# EAGLE design Writer (EAGLE 6.5.0)
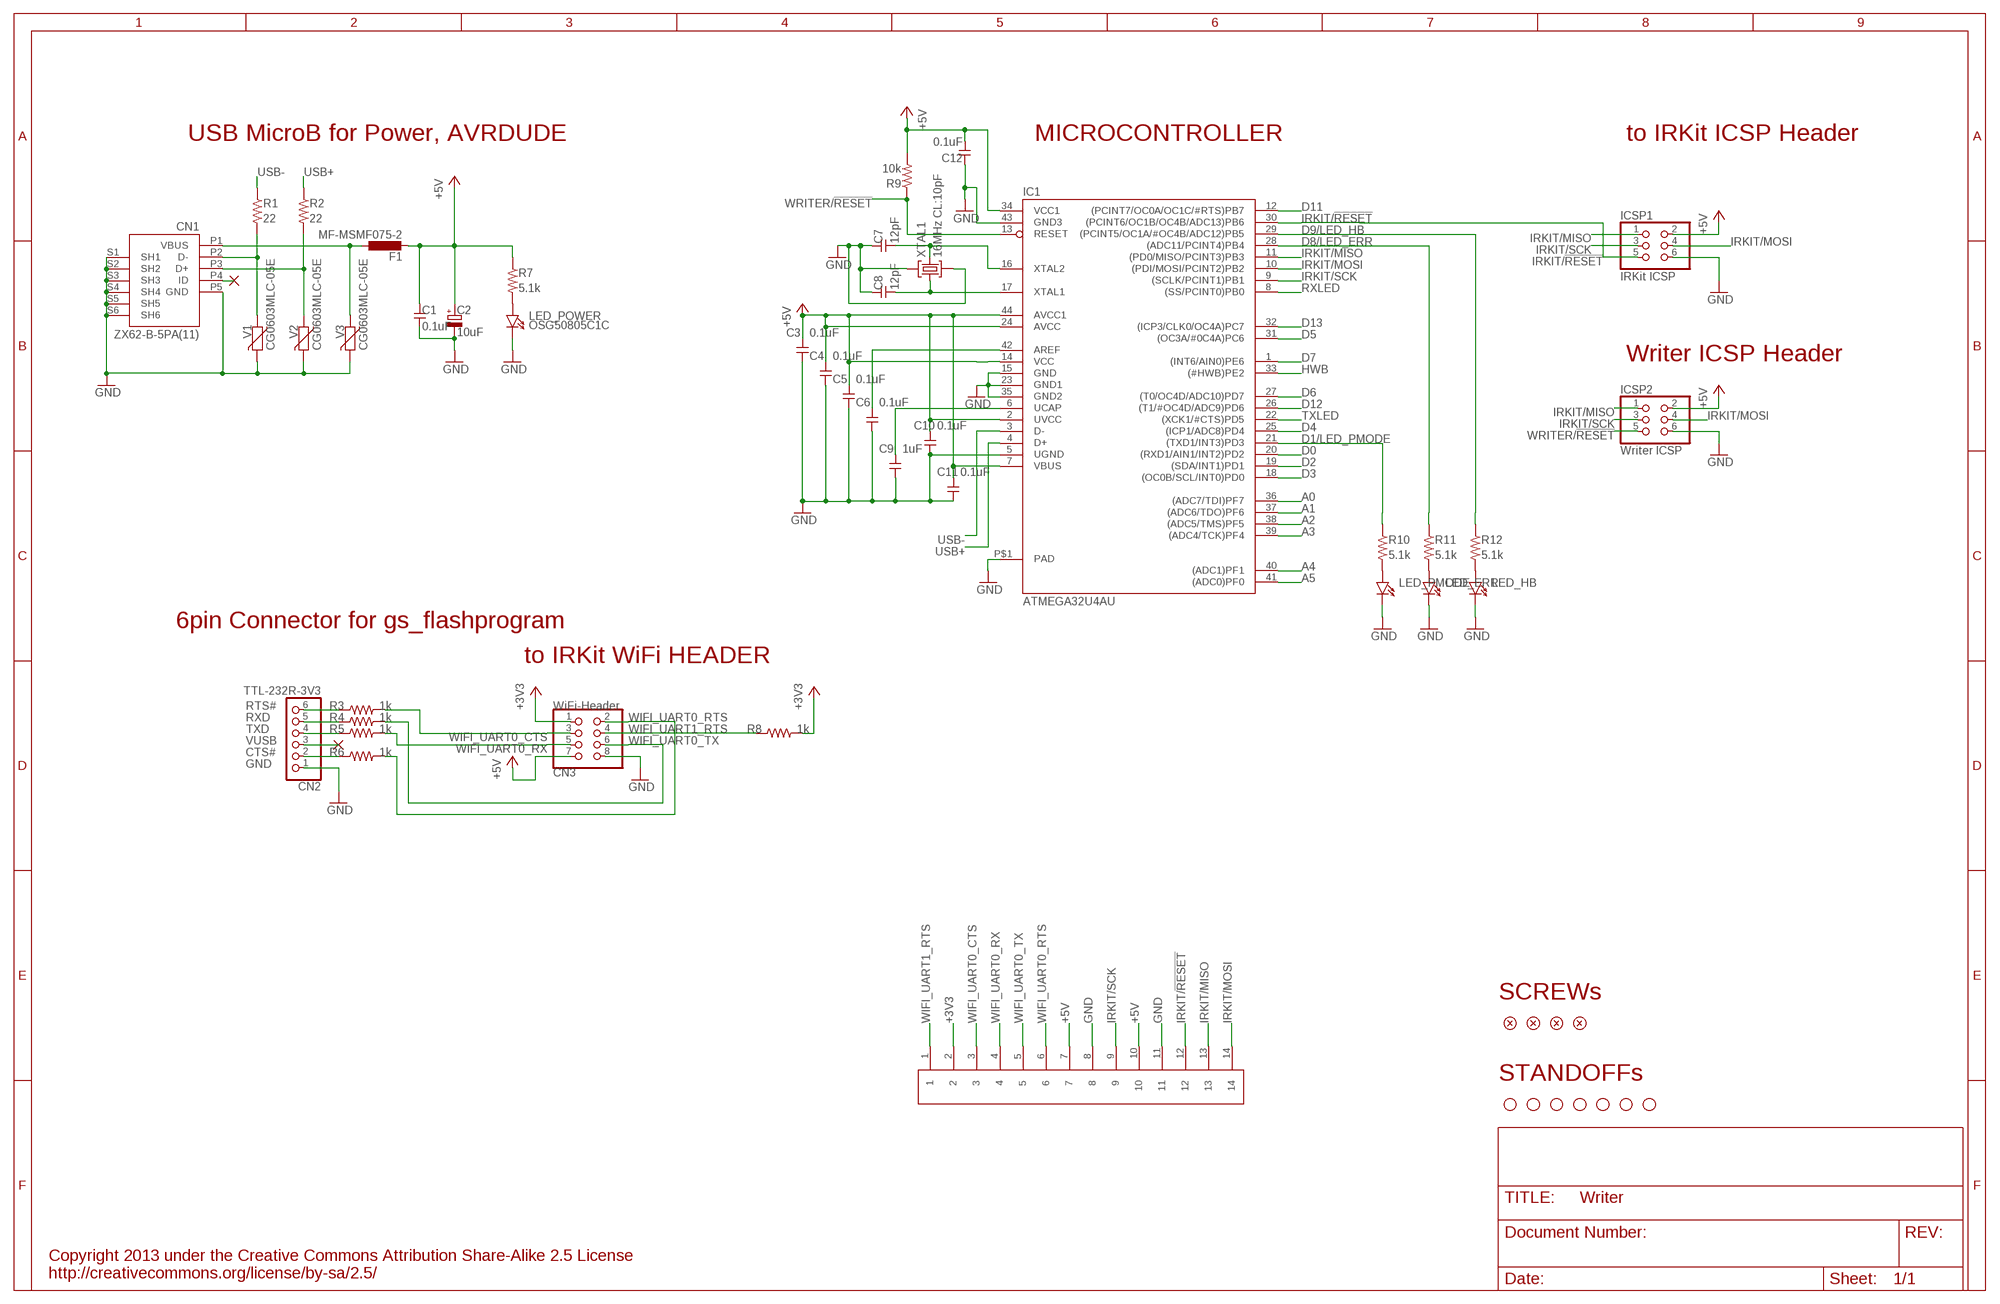
[diagram p0: schematic, sheet 1]

## Parts
C1  0.1uF  CAPACITOR2012  [SMD2012]
C2  10uF  CAPACITOR-POLPANASONIC_B  [PANASONIC_B]
C3  0.1uF  CAPACITOR2012  [SMD2012]
C4  0.1uF  CAPACITOR2012  [SMD2012]
C5  0.1uF  CAPACITOR2012  [SMD2012]
C6  0.1uF  CAPACITOR2012  [SMD2012]
C7  12pF  CAPACITOR2012  [SMD2012]
C8  12pF  CAPACITOR2012  [SMD2012]
C9  1uF  CAPACITOR2012  [SMD2012]
C10  0.1uF  CAPACITOR2012  [SMD2012]
C11  0.1uF  CAPACITOR2012  [SMD2012]
C12  0.1uF  CAPACITOR2012  [SMD2012]
CN1  ZX62-B-5PA(11)  USB-CONNECTORMICROB  [USB-MICROB]
CN2  TTL-232R-3V3  PINHD-1X6/90  [1X06/90]
CN3  WiFi-Header  PINHD-2X4/D1.1  [2X04/D1.1]
CN4  SOCKET-HEADER-7614-5002  [SOCKET-HEADER-7614-5002]
F1  MF-MSMF075-2  L-EUL1812  [L1812]
IC1  ATMEGA32U4AU  [TQFP44-PAD]
ICSP1  IRKit ICSP  PINHD-2X3/D1.1  [2X03/D1.1]
ICSP2  Writer ICSP  PINHD-2X3  [2X03]
LED_ERR  LED-2012  [LED2012]
LED_HB  LED-2012  [LED2012]
LED_PMODE  LED-2012  [LED2012]
LED_POWER  OSG50805C1C  LED-2012  [LED2012]
R1  22  RESISTOR-US2012  [SMD2012]
R2  22  RESISTOR-US2012  [SMD2012]
R3  1k  RESISTOR-US2012  [SMD2012]
R4  1k  RESISTOR-US2012  [SMD2012]
R5  1k  RESISTOR-US2012  [SMD2012]
R6  1k  RESISTOR-US2012  [SMD2012]
R7  5.1k  RESISTOR-US2012  [SMD2012]
R8  1k  RESISTOR-US2012  [SMD2012]
R9  10k  RESISTOR-US2012  [SMD2012]
R10  5.1k  RESISTOR-US2012  [SMD2012]
R11  5.1k  RESISTOR-US2012  [SMD2012]
R12  5.1k  RESISTOR-US2012  [SMD2012]
SCREW1  flat-head M3 self-tapping  SCREW  [SCREW-M3]
SCREW2  flat-head M3 self-tapping  SCREW  [SCREW-M3]
SCREW3  flat-head M3 self-tapping  SCREW  [SCREW-M3]
SCREW4  flat-head M3 self-tapping  SCREW  [SCREW-M3]
STANDOFF1  STAND-OFF  [STAND-OFF]
STANDOFF2  STAND-OFF  [STAND-OFF]
STANDOFF3  STAND-OFF  [STAND-OFF]
STANDOFF4  STAND-OFF  [STAND-OFF]
STANDOFF5  STAND-OFF  [STAND-OFF]
STANDOFF6  STAND-OFF  [STAND-OFF]
STANDOFF7  STAND-OFF  [STAND-OFF]
V1  CG0603MLC-05E  VARISTORCN0603  [CT/CN0603]
V2  CG0603MLC-05E  VARISTORCN0603  [CT/CN0603]
V3  CG0603MLC-05E  VARISTORCN0603  [CT/CN0603]
XTAL1  16MHz CL:10pF  CRYSTAL-3.2-2.5  [CRYSTAL-3.2-2.5]

## Nets
+3V3 [3.3v]: CN3.1 CN4.2 R8.2
+5V [power]: C1.1 C2.+ C3.2 C4.2 C5.2 C10.2 C11.2 C12.2 CN3.7 CN4.7 CN4.10 F1.2 IC1.2(UVCC) IC1.7(VBUS) IC1.14(VCC) IC1.24(AVCC) IC1.34(VCC1) IC1.44(AVCC1) ICSP1.2 ICSP2.2 R7.1 R9.2
A0: IC1.36((ADC7/TDI)PF7)
A1: IC1.37((ADC6/TDO)PF6)
A2: IC1.38((ADC5/TMS)PF5)
A3: IC1.39((ADC4/TCK)PF4)
A4: IC1.40((ADC1)PF1)
A5: IC1.41((ADC0)PF0)
AREF [power]: C6.2 IC1.42(AREF)
CTS#: CN2.2 R6.1
D0: IC1.20((RXD1/AIN1/INT2)PD2)
D1/LED_PMODE: IC1.21((TXD1/INT3)PD3) R10.1
D2: IC1.19((SDA/INT1)PD1)
D3: IC1.18((OC0B/SCL/INT0)PD0)
D4: IC1.25((ICP1/ADC8)PD4)
D5: IC1.31((OC3A/#0C4A)PC6)
D6: IC1.27((T0/OC4D/ADC10)PD7)
D7: IC1.1((INT6/AIN0)PE6)
D8/LED_ERR: IC1.28((ADC11/PCINT4)PB4) R11.1
D9/LED_HB: IC1.29((PCINT5/OC1A/#OC4B/ADC12)PB5) R12.1
D11: IC1.12((PCINT7/OC0A/OC1C/#RTS)PB7)
D12: IC1.26((T1/#OC4D/ADC9)PD6)
D13: IC1.32((ICP3/CLK0/OC4A)PC7)
GND [gnd]: C1.2 C2.- C3.1 C4.1 C5.1 C6.1 C7.1 C8.1 C9.1 C10.1 C11.1 C12.1 CN1.P5(GND) CN1.S1(SH1) CN1.S2(SH2) CN1.S3(SH3) CN1.S4(SH4) CN1.S5(SH5) CN1.S6(SH6) CN2.1 CN3.8 CN4.8 CN4.11 IC1.5(UGND) IC1.15(GND) IC1.23(GND1) IC1.35(GND2) IC1.43(GND3) IC1.P$1(PAD) ICSP1.6 ICSP2.6 LED_ERR.K LED_HB.K LED_PMODE.K LED_POWER.K V1.2 V2.2 V3.2 XTAL1.2(GND) XTAL1.4(GND)
HWB: IC1.33((#HWB)PE2)
IRKIT/!RESET: CN4.12 IC1.30((PCINT6/OC1B/OC4B/ADC13)PB6) ICSP1.5
IRKIT/MISO: CN4.13 IC1.11((PD0/MISO/PCINT3)PB3) ICSP1.1 ICSP2.1
IRKIT/MOSI: CN4.14 IC1.10((PDI/MOSI/PCINT2)PB2) ICSP1.4 ICSP2.4
IRKIT/SCK: CN4.9 IC1.9((SCLK/PCINT1)PB1) ICSP1.3 ICSP2.3
N$1: LED_PMODE.A R10.2
N$2: LED_ERR.A R11.2
N$3: LED_POWER.A R7.2
N$4: LED_HB.A R12.2
N$48: CN1.P2(D-) R1.2 V1.1
N$51: CN1.P3(D+) R2.2 V2.1
N$52: CN1.P1(VBUS) F1.1 V3.1
RTS#: CN2.6 R3.1
RXD: CN2.5 R4.1
RXLED: IC1.8((SS/PCINT0)PB0)
TXD: CN2.4 R5.1
TXLED: IC1.22((XCK1/#CTS)PD5)
UCAP: C9.2 IC1.6(UCAP)
USB+: IC1.4(D+) R2.1
USB-: IC1.3(D-) R1.1
USB-ID: CN1.P4(ID)
VUSB: CN2.3
WIFI_UART0_CTS: CN3.3 CN4.3 R3.2
WIFI_UART0_RTS: CN3.2 CN4.6 R6.2
WIFI_UART0_RX: CN3.5 CN4.4 R5.2
WIFI_UART0_TX: CN3.6 CN4.5 R4.2
WIFI_UART1_RTS: CN3.4 CN4.1 R8.1
WRITER/!RESET: IC1.13(RESET) ICSP2.5 R9.1
XTAL1: C8.2 IC1.17(XTAL1) XTAL1.1(C1)
XTAL2: C7.2 IC1.16(XTAL2) XTAL1.3(C2)

## Notes on the sheet
- USB MicroB for Power, AVRDUDE | MICROCONTROLLER | to IRKit ICSP Header
- Writer ICSP Header
- 6pin Connector for gs_flashprogram
- to IRKit WiFi HEADER
- SCREWs
- STANDOFFs
- Copyright 2013 under the Creative Commons Attribution Share-Alike 2.5 License
  http://creativecommons.org/license/by-sa/2.5/

## Library data of the parts
C1 C3-C12 = my:CAPACITOR: Generic Capacitor
C2 = my:CAPACITOR-POL: Generic Capacitor with Polarity
CN1 = my:USB-CONNECTOR
CN2 = my:PINHD-1X6: PIN HEADER
CN3 = my:PINHD-2X4: PIN HEADER
CN4 = my:SOCKET-HEADER: Sumitomo Standard Socket <www.mmm.co.jp/electrical/connector/list_c.html>
F1 = my:L-EU: INDUCTOR, European symbol
IC1 = my:ATMEGA32U4
ICSP1 ICSP2 = my:PINHD-2X3: PIN HEADER
LED_ERR LED_HB LED_PMODE LED_POWER = my:LED: Through-hole LED
R1-R12 = my:RESISTOR-US: Generic Registor
SCREW1-SCREW4 = my:SCREW
STANDOFF1-STANDOFF7 = my:STAND-OFF: #4 Stand Off This is the mechanical footprint for a #4 phillips button head screw. Use the keepout ring to avoid running the screw head into surrounding components. SKU : PRT-00447
V1-V3 = my:VARISTOR: VARISTOR
XTAL1 = my:CRYSTAL-3.2-2.5

## Net classes
0 default: width 0.254 mm
1 power: width 0.406 mm
2 ir-power: width 0.813 mm
3 gnd: width 0.406 mm
4 3.3v: width 0.406 mm

## Board
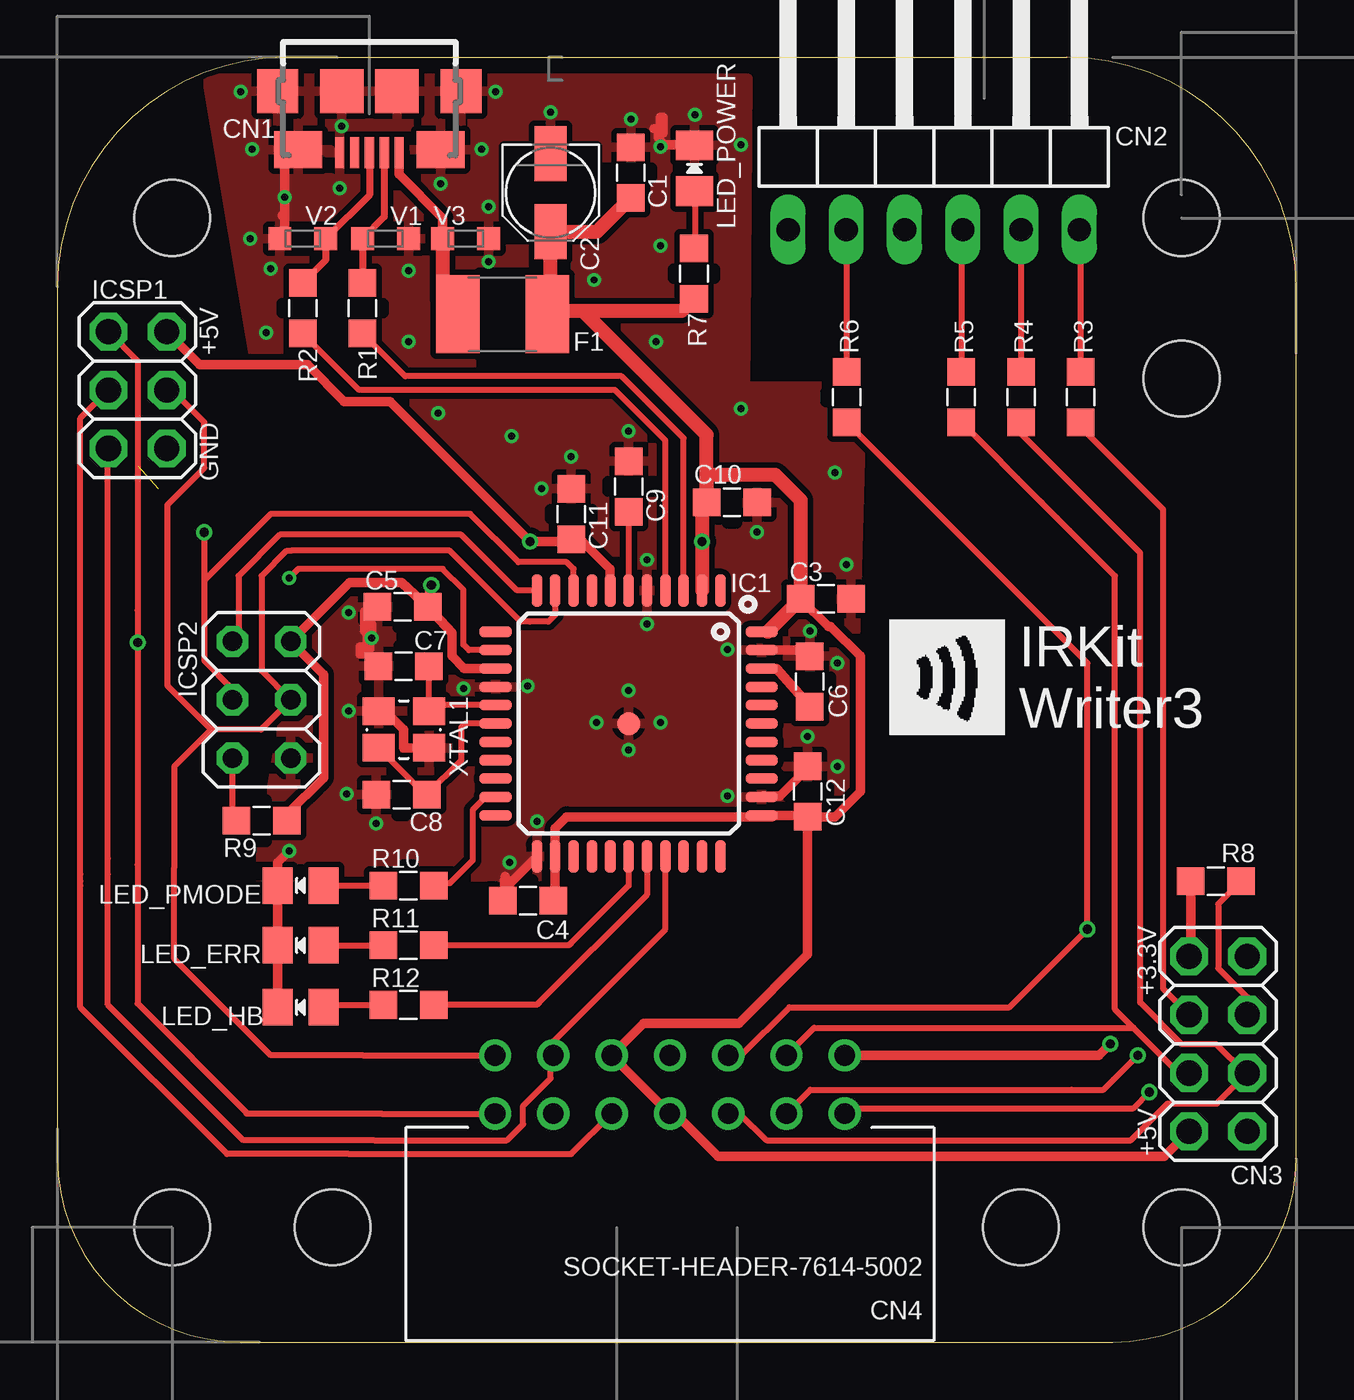
[diagram p1: board, top side]
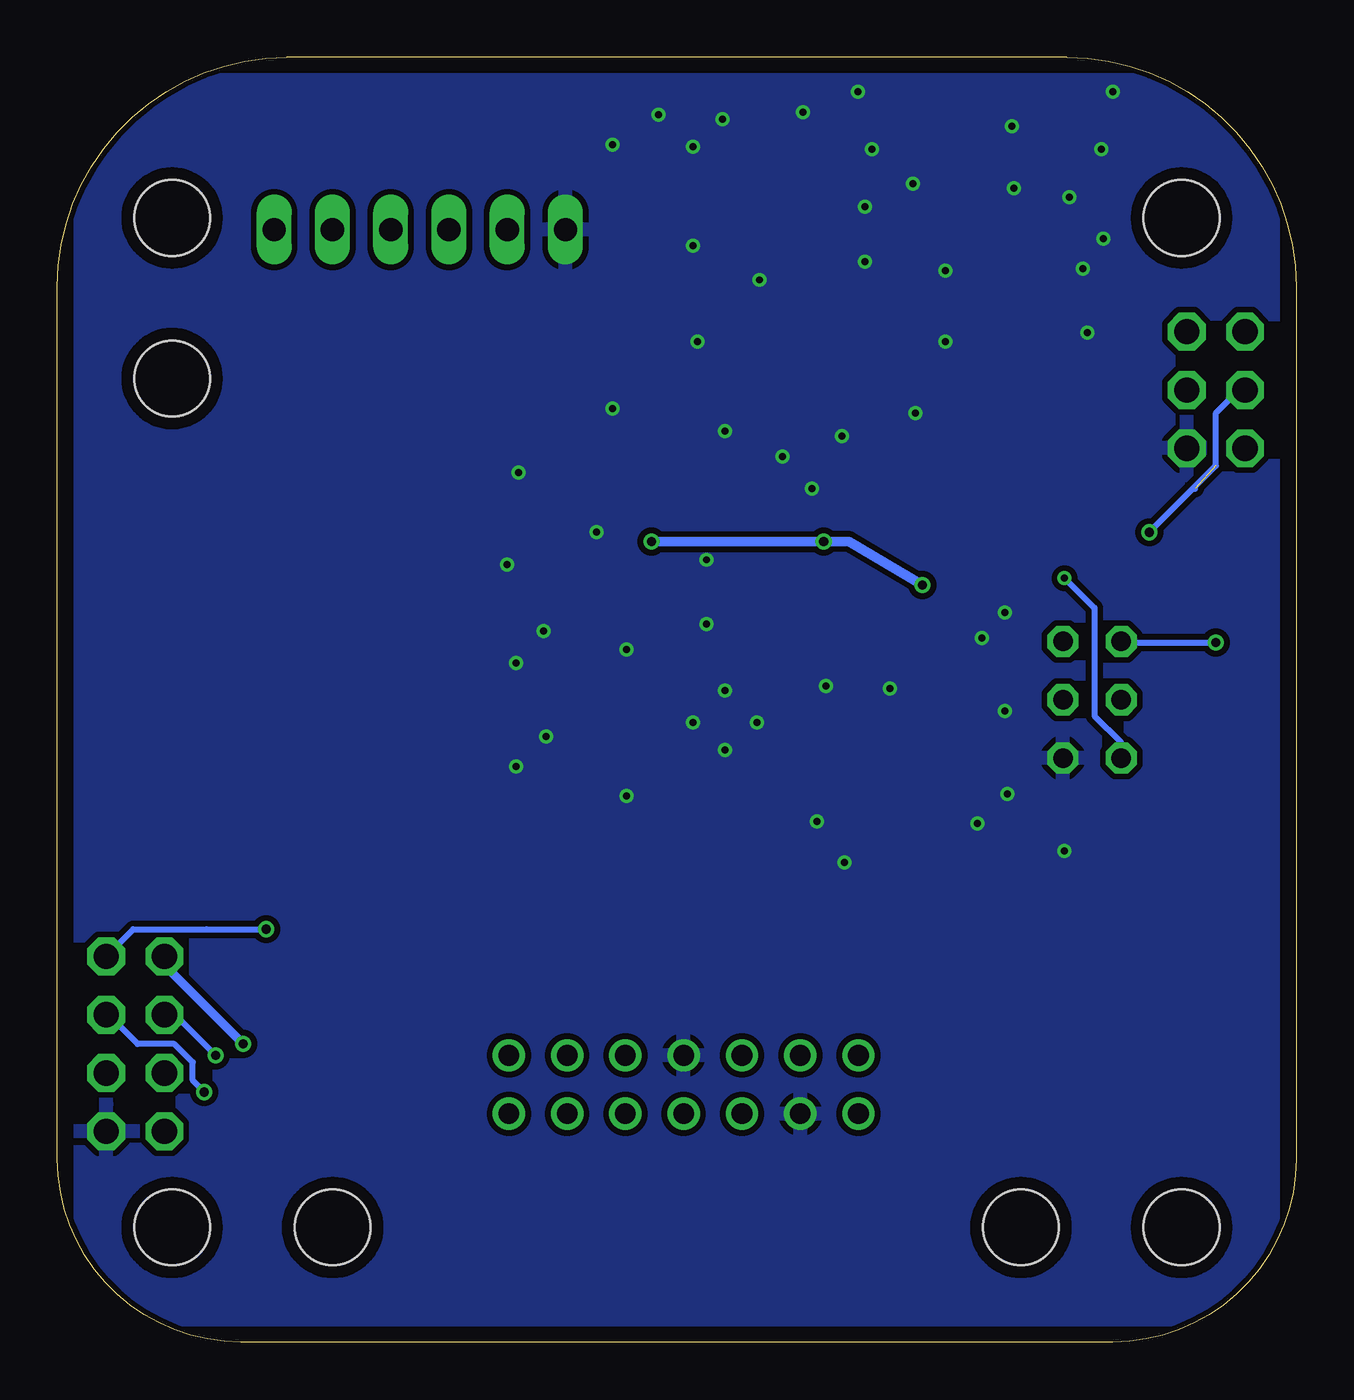
[diagram p2: board, bottom side, seen from below]

Size 54 x 56 mm. Coordinates in mm from the lower left corner, seen from the top.
Outline: 8,0 46,0 arc90 54,8 54,17.5 54,34.8 54,46 arc90 44,56 34.1,56 34,56 20,56 10,56 arc90 0,46 0,8 arc90 8,0
Copper layers (1*16): Top 0.035mm / dielectric 1.5mm / Bottom 0.035mm
Design rules "Fusion_eagle_rule_v1.1": minimum track width 6mil, minimum drill 12mil, track to track 6mil, track to pad 6mil, pad to pad 6mil, via to via 6mil, smd to smd 0mil, copper to edge 10mil, drill to drill 10mil, minimum pad ring 10mil, minimum via ring 6mil, stop-mask expansion 2mil, vias tented up to drill 100mil, thermal gap 10mil

### Footprints (pad centres in the part's own frame; a part is rotated, then mirrored left to right if it is on the bottom)
SMD2012 = smd 1.2 x 1.2: 1 -1.1,0; 2 1.1,0
PANASONIC_B = smd 2.4 x 1.4: + 1.7,0; - -1.7,0
USB-MICROB = smd 0.4 x 1.35: P1 -1.3,2.675; P2 -0.65,2.675; P3 0,2.675; P4 0.65,2.675; P5 1.3,2.675 | smd 1.8 x 1.9: S1 -4,0; S2 4,0 | smd 2.1 x 1.6: S3 -3.1,2.55; S4 3.1,2.55 | smd 1.9 x 1.9: S5 -1.2,0; S6 1.2,0
1X06/90 = drill 1.016 long: 1 -6.35,-3.81; 2 -3.81,-3.81; 3 -1.27,-3.81; 4 1.27,-3.81; 5 3.81,-3.81; 6 6.35,-3.81
2X04/D1.1 = drill 1.1 octagon: 1 -3.81,-1.27; 2 -3.81,1.27; 3 -1.27,-1.27; 4 -1.27,1.27; 5 1.27,-1.27; 6 1.27,1.27; 7 3.81,-1.27; 8 3.81,1.27
SOCKET-HEADER-7614-5002 = drill 0.9: 1 -7.62,2.54; 2 -7.62,0; 3 -5.08,2.54; 4 -5.08,0; 5 -2.54,2.54; 6 -2.54,0; 7 0,2.54; 8 0,0; 9 2.54,2.54; 10 2.54,0; 11 5.08,2.54; 12 5.08,0; 13 7.62,2.54; 14 7.62,0
L1812 = smd 1.9 x 3.4: 1 -1.95,0; 2 1.95,0
TQFP44-PAD = smd 1.4 x 0.45: 1 -5.8,4; 2 -5.8,3.2; 3 -5.8,2.4; 4 -5.8,1.6; 5 -5.8,0.8; 6 -5.8,0; 7 -5.8,-0.8; 8 -5.8,-1.6; 9 -5.8,-2.4; 10 -5.8,-3.2; 11 -5.8,-4; 23 5.8,-4; 24 5.8,-3.2; 25 5.8,-2.4; 26 5.8,-1.6; 27 5.8,-0.8; 28 5.8,0; 29 5.8,0.8; 30 5.8,1.6; 31 5.8,2.4; 32 5.8,3.2; 33 5.8,4 | smd 0.45 x 1.4: 12 -4,-5.8; 13 -3.2,-5.8; 14 -2.4,-5.8; 15 -1.6,-5.8; 16 -0.8,-5.8; 17 0,-5.8; 18 0.8,-5.8; 19 1.6,-5.8; 20 2.4,-5.8; 21 3.2,-5.8; 22 4,-5.8; 34 4,5.8; 35 3.2,5.8; 36 2.4,5.8; 37 1.6,5.8; 38 0.8,5.8; 39 0,5.8; 40 -0.8,5.8; 41 -1.6,5.8; 42 -2.4,5.8; 43 -3.2,5.8; 44 -4,5.8 | smd 1 x 1: P$1 0,0
2X03/D1.1 = drill 1.1 octagon: 1 -2.54,-1.27; 2 -2.54,1.27; 3 0,-1.27; 4 0,1.27; 5 2.54,-1.27; 6 2.54,1.27
2X03 = drill 0.85 octagon: 1 -2.54,-1.27; 2 -2.54,1.27; 3 0,-1.27; 4 0,1.27; 5 2.54,-1.27; 6 2.54,1.27
LED2012 = smd 1.3 x 1.6: A -1,0; K 1,0
STAND-OFF = hole 3.302: 0,0
CT/CN0603 = smd 1 x 1: 1 -1,0; 2 1,0
CRYSTAL-3.2-2.5 = smd 1.4 x 1.2: 1 -1.1,-0.8; 2 1.1,-0.8; 3 1.1,0.8; 4 -1.1,0.8

### Placement (x,y rotation side)
C1  25,50.97 90 top
C2  21.5,50.1 270 top
C3  33.5,32.4 180 top
C4  20.51,19.25 0 top
C5  15.05,32.05 0 top
C6  32.8,28.8 270 top
C7  15.1,29.46 0 top
C8  15,23.86 0 top
C9  24.9,37.3 270 top
C10  29.4,36.6 180 top
C11  22.4,36.1 270 top
C12  32.7,24 270 top
CN1  13.6,54.52 180 top
CN2  38.2,52.3 0 top
CN3  50.6,13 270 top
CN4  26.7,12.5 180 top
F1  19.4,44.8 0 top
IC1  24.9,26.96 270 top
ICSP1  3.5,41.5 270 top
ICSP2  8.9,28 270 top
LED_ERR  10.6,17.3 180 top
LED_HB  10.6,14.6 180 top
LED_PMODE  10.6,19.9 180 top
LED_POWER  27.77,51.16 90 top
R1  13.3,45.06 90 top
R2  10.7,45.06 90 top
R3  44.6,41.2 270 top
R4  42,41.2 270 top
R5  39.4,41.2 270 top
R6  34.4,41.2 270 top
R7  27.75,46.58 90 top
R8  50.5,20.1 180 top
R9  8.9,22.73 0 top
R10  15.3,19.9 180 top
R11  15.3,17.3 180 top
R12  15.3,14.7 180 top
SCREW1  -7.4,-11.1 0 top  (outside the outline)
SCREW2  -8.4,-12.2 0 top  (outside the outline)
SCREW3  -9.4,-13.3 0 top  (outside the outline)
SCREW4  -10.4,-14.4 0 top  (outside the outline)
STANDOFF1  49,5 0 top
STANDOFF2  5,5 0 top
STANDOFF3  49,49 0 top
STANDOFF4  5,49 0 top
STANDOFF5  12,5 0 top
STANDOFF6  42,5 0 top
STANDOFF7  49,42 0 top
U$1  [IRKIT-LOGO]  36.3,26.5 0 top
V1  14.3,48.1 0 top
V2  10.7,48.1 180 top
V3  17.8,48.1 0 top
XTAL1  15.1,26.7 0 top

### Tracks (layer width: path | path; a pad name or v marks a point on that pad's centre or on a via)
+3V3  (via drill 0.4)
  Top 0.406: R8.2 49.4,16.9 CN3.1 | CN4.2 45.4,12.5 v45.9,13
  Bottom 0.406: v45.9,13 49.33,16.43 CN3.1
+5V  (via drill 0.4)
  Top 0.406: v20.6,34.9 22.5,34.9 | 20.6,34.8 v20.6,34.9 | v20.6,34.9 14.5,41 12.5,41 10.9,42.6 9.9,42.6 6.21,42.6 ICSP1.2 | C5.2 15,33.1 13.3,33.1 12.73,33.1 ICSP2.2 11.6,29.11 11.6,24.6 10,23 R9.2 | v16.3,33 16.25,32.95 C5.2 | C5.2 17.2,30.9 17.2,29.9 17.74,29.36 IC1.14 | 49.33,9.13 CN3.7 48.24,8.1 28.8,8.1 26.94,9.96 CN4.7 CN4.10 25.56,13.9 29.6,13.9 29.7,13.9 32.7,16.9 C12.2 | IC1.7 24.1,33.7 22.9,34.9 22.5,34.9 | 22.5,34.9 C11.2 | IC1.44 30.96,30.96 | IC1.34 31.2,22.96 | 31.2,22.96 32.64,22.96 C12.2 | C12.2 33.9,22.9 35,24 35,29.9 33.7,31.2 33.6,31.2 C3.2 | 31.2,22.96 31.14,22.9 22.2,22.9 21.7,22.4 IC1.24 21.7,19.34 C4.2
  Top 0.61: IC1.2 v28.1,34.9 28.1,36.4 C10.2 28.3,37.8 | 30.96,30.96 C3.2 32.4,36.7 31.3,37.8 28.3,37.8 | F1.2 21.5,44.95 | 21.5,44.95 C2.+ 23.52,48.4 C1.1 | 21.5,44.95 22.9,44.95 | 22.9,44.95 27.23,44.95 R7.1 | 28.3,37.8 28.3,39.55 22.9,44.95 | 28.3,37.8 28.3,36.5
  Top 0.813: 21.35,48.25 C2.+ | 27.73,45.5 R7.1
  Bottom 0.406: v28.1,34.9 v20.6,34.9 19.5,34.9 v16.3,33
AREF
  Top 0.406: IC1.42 31.34,29.36 C6.2
CTS#
  Top 0.254: R6.1 34.4,48.4 CN2.2
D1/LED_PMODE
  Top 0.254: IC1.21 19.1,23.7 18.6,23.7 18.1,23.2 18.1,21 17.1,20 16.5,20 R10.1
D8/LED_ERR
  Top 0.254: IC1.28 24.9,21.1 24.9,19.9 22.4,17.4 22.3,17.3 R11.1
D9/LED_HB
  Top 0.254: IC1.29 25.7,21.1 25.7,19.5 21,14.8 20.9,14.7 R12.1
GND  (via drill 0.3)
  Top 0.406: LED_POWER.K 27.7,52.2 26.4,52.2 26.3,52.3 26.3,52.4 26.2,52.5 26.2,52.8 26.3,52.9 26.3,53.4 26.4,53.4 26.4,52.7 26.3,52.7 26.3,52.8 26.2,52.9 26,52.9 | 19.51,20.3 19.5,20.1 19.6,20 19.6,19.8 19.7,19.8 19.7,20.1 19.6,20.1 19.5,20 19.5,19.3 C4.1 19.41,19.68 IC1.23 | XTAL1.2 15.1,25.9 15.1,26.7 14.4,27.4 XTAL1.4 | V2.2 9.9,48.3 9.9,49.1 | 9.9,49.1 9.9,51.3 10.5,51.9 | 10.5,51.9 CN1.S4 10.5,51.9 | v13.7,30.7 13.7,31.3 13.5,31.3 13.5,31 13.6,30.9 13.6,30.2 13.5,30.1 13.4,30.2 13.4,30.3 13.2,30.3 13.2,30 13.3,30 13.5,30.2 13.5,30.9 13.4,31 13.4,31.5 13.4,31.85 | 10.5,51.9 10.5,51.78 | 9.8,49.1 9.9,49.1 | IC1.43 32.46,30.16 C6.1 | IC1.35 30.74,23.8 31.5,23.8 32.7,25 C12.1 | LED_HB.K 9.6,17.1 LED_ERR.K LED_PMODE.K 9.6,20.1 9.6,20.9 v10.1,21.4
  other vias: 22.4,38.6 12.3,50.3 15.3,46.7 18.8,49.5 34.4,33.9 9.9,49.9 8.5,52 19.1,54.5 18.5,52 16.7,50.5 15.3,43.6 21.5,53.6 25,53.3 26.3,52.1 26.3,47.8 30.5,35.3 24.9,39.7 16.6,40.5 23.4,46.3 12.7,31.8 12.7,27.5 12.6,23.9 19.7,20.9 20.5,28.6 20.9,22.7 24.9,25.8 26.3,27 23.5,27 24.9,28.4 25.7,31.3 29.2,30.2 29.2,23.8 34,25.1 32.7,26.4 34,29.6 29.8,40.7 21.1,37.2 33.9,37.9 19.8,39.5 26.1,43.6 29.8,52.2 27.8,53.5 25.7,34.1 9.1,44 8,54.5 12.4,53 8.4,48.1 9.3,46.8 32.8,31 18.8,47.1 17.7,28.5 13.9,22.6
  pour Bottom (isolate 0.254): 1,1 1,55 53,55 53,1
  pour Top (isolate 0.254): 12.2,41.6 35.1,41.7 34.5,20.2 8.7,20.3
  pour Top (isolate 0.254): 30,41.4 8.8,41.5 6.5,55.1 30.1,55.1
IRKIT/!RESET
  Top 0.254: 2.2,20.4 2.2,21.1 | 2.2,21.1 2.2,38.93 2.3,39 ICSP1.5 | IC1.30 26.5,18 21.62,13.12 CN4.12 21.5,12.38 21.5,11.5 20.3,10.3 20.3,9.5 19.6,8.8 13.8,8.8 8.1,8.8 2.2,14.7 2.2,21.1
IRKIT/MISO  (via drill 0.4)
  Top 0.254: CN4.13 14.14,9.96 8.3,9.96 | IC1.11 20.04,32.76 17.6,35.2 9.7,35.2 7.9,33.4 7.9,30.81 ICSP2.1 | 8.3,9.96 8.24,9.96 | ICSP1.1 3.5,42.77 3.5,31.9 v3.5,30.5 3.5,20.8 3.5,14.76 8.3,9.96
  Bottom 0.254: ICSP2.1 7.59,30.5 v3.5,30.5
IRKIT/MOSI
  Top 0.254: IC1.10 21.7,31.7 21.4,31.4 20.6,31.4 20.2,31.4 18.1,33.5 17.1,34.5 10.2,34.5 10,34.5 8.9,33.4 8.9,29.27 ICSP2.4 | 10.17,28.13 ICSP2.4 | ICSP2.4 8.97,26.8 8.87,26.7 6.7,26.7 | CN4.14 13.3,12.5 9.3,12.5 5.2,16.6 5.1,16.7 5.1,20.7 5.1,25.1 6.7,26.7 | 6.7,26.7 4.8,28.6 4.8,36.5 6.4,38.1 6.4,40.1 5,41.5 ICSP1.4
IRKIT/SCK  (via drill 0.4)  (1 unrouted)
  Top 0.254: 1,20.1 1,20.4 | 1,20.4 1,40.27 ICSP1.3 | 1,20.4 1,19.9 1,14.6 7.4,8.2 12.7,8.2 19.7,8.2 22.4,8.2 CN4.9 | IC1.9 22.5,33.7 22.2,34 20.1,34 18,36.1 9.3,36.1 6.4,33.2 6.4,33 | 6.4,33 6.4,29.7 7.63,28.47 ICSP2.3 | v6.4,35.3 6.4,33
  Bottom 0.254: 4.4,37.2 4.5,37.2 | ICSP1.3 2.3,41.5 2.4,41.5 2.5,41.5 3.5,40.5 3.5,38.2 v6.4,35.3
N$1
  Top 0.254: LED_PMODE.A R10.2
N$2
  Top 0.254: LED_ERR.A R11.2
N$3
  Top 0.254: R7.2 27.8,47.7 27.8,50.1 LED_POWER.A
N$4
  Top 0.254: 11.6,14.7 R12.2
  Top 0.406: LED_HB.A 11.6,14.7
N$48
  Top 0.305: CN1.P2 14.25,49.05 V1.1 R1.2
N$51
  Top 0.305: CN1.P3 13.6,50 V2.1 11.7,47.16 R2.2
N$52
  Top 0.406: CN1.P1 14.9,50.9 16.8,49 V3.1
  Top 0.61: V3.1 16.8,45.45 F1.1
RTS#
  Top 0.254: R3.1 44.6,48.4 CN2.6
RXD
  Top 0.254: R4.1 42,48.4 CN2.5
TXD
  Top 0.254: R5.1 39.4,48.4 CN2.4
UCAP
  Top 0.254: C9.2 IC1.6
USB+
  Top 0.254: IC1.4 26.5,39.3 24.3,41.5 13.16,41.5 R2.1
USB-
  Top 0.254: IC1.3 27.3,39.4 24.6,42.1 15.16,42.1 R1.1
WIFI_UART0_CTS  (via drill 0.4)
  Top 0.254: CN3.3 49.3,14.3 48.2,15.4 48.2,36.3 44.6,39.9 R3.2 | CN4.3 32.82,11 44.2,11 45.6,11 v47.1,12.5
  Bottom 0.254: v47.1,12.5 48.87,14.27 CN3.3
WIFI_UART0_RTS  (via drill 0.4)
  Top 0.254: 51.9,16.8 CN3.2 | R6.2 44.9,29.6 v44.9,18 41.5,14.6 31.9,14.6 29.8,12.5 CN4.6
  Bottom 0.254: v44.9,18 47.5,18 50.7,18 50.7,17.98 CN3.2
WIFI_UART0_RX
  Top 0.254: R5.2 42.9,36.6 46.1,33.4 46.1,14.5 46.9,13.7 | CN3.5 49.3,11.8 48.8,11.8 46.9,13.7 | CN4.4 32.98,13.7 46.9,13.7
WIFI_UART0_TX
  Top 0.254: R4.2 42,39.6 47.2,34.4 47.2,14.8 49,13 50.5,13 51.77,11.73 CN3.6 50.54,10.4 48.4,10.4 46.8,8.8 30.9,8.8 29.74,9.96 CN4.5
WIFI_UART1_RTS  (via drill 0.4)
  Top 0.254: R8.1 50.9,19.4 50.6,19.1 50.6,16.3 51.87,15.03 CN3.4 51.8,14.3 | CN4.1 34.56,10.2 46.9,10.2 v47.6,10.9
  Bottom 0.254: CN3.4 51.77,14.27 50.5,13 48.9,13 48.1,12.2 48.1,11.4 v47.6,10.9
WRITER/!RESET  (via drill 0.3)
  Top 0.254: ICSP2.5 7.63,23.2 R9.1 | IC1.13 17.94,30.16 17.7,30.4 17.7,32.8 16.8,33.7 12.5,33.7 10.5,33.7 v10.1,33.3
  Bottom 0.254: v10.1,33.3 8.8,32 8.8,27.3 7.63,26.13 ICSP2.5
XTAL1
  Top 0.254: IC1.17 17.76,26.96 17.6,26.8 17.6,25.36 C8.2 16.04,23.86 XTAL1.1
XTAL2
  Top 0.254: C7.2 16.2,29.5 XTAL1.3 16.46,27.76 IC1.16

### Text on the board
tPlace: +5V | GND | IRKit / Writer3 | +3.3V | +5V